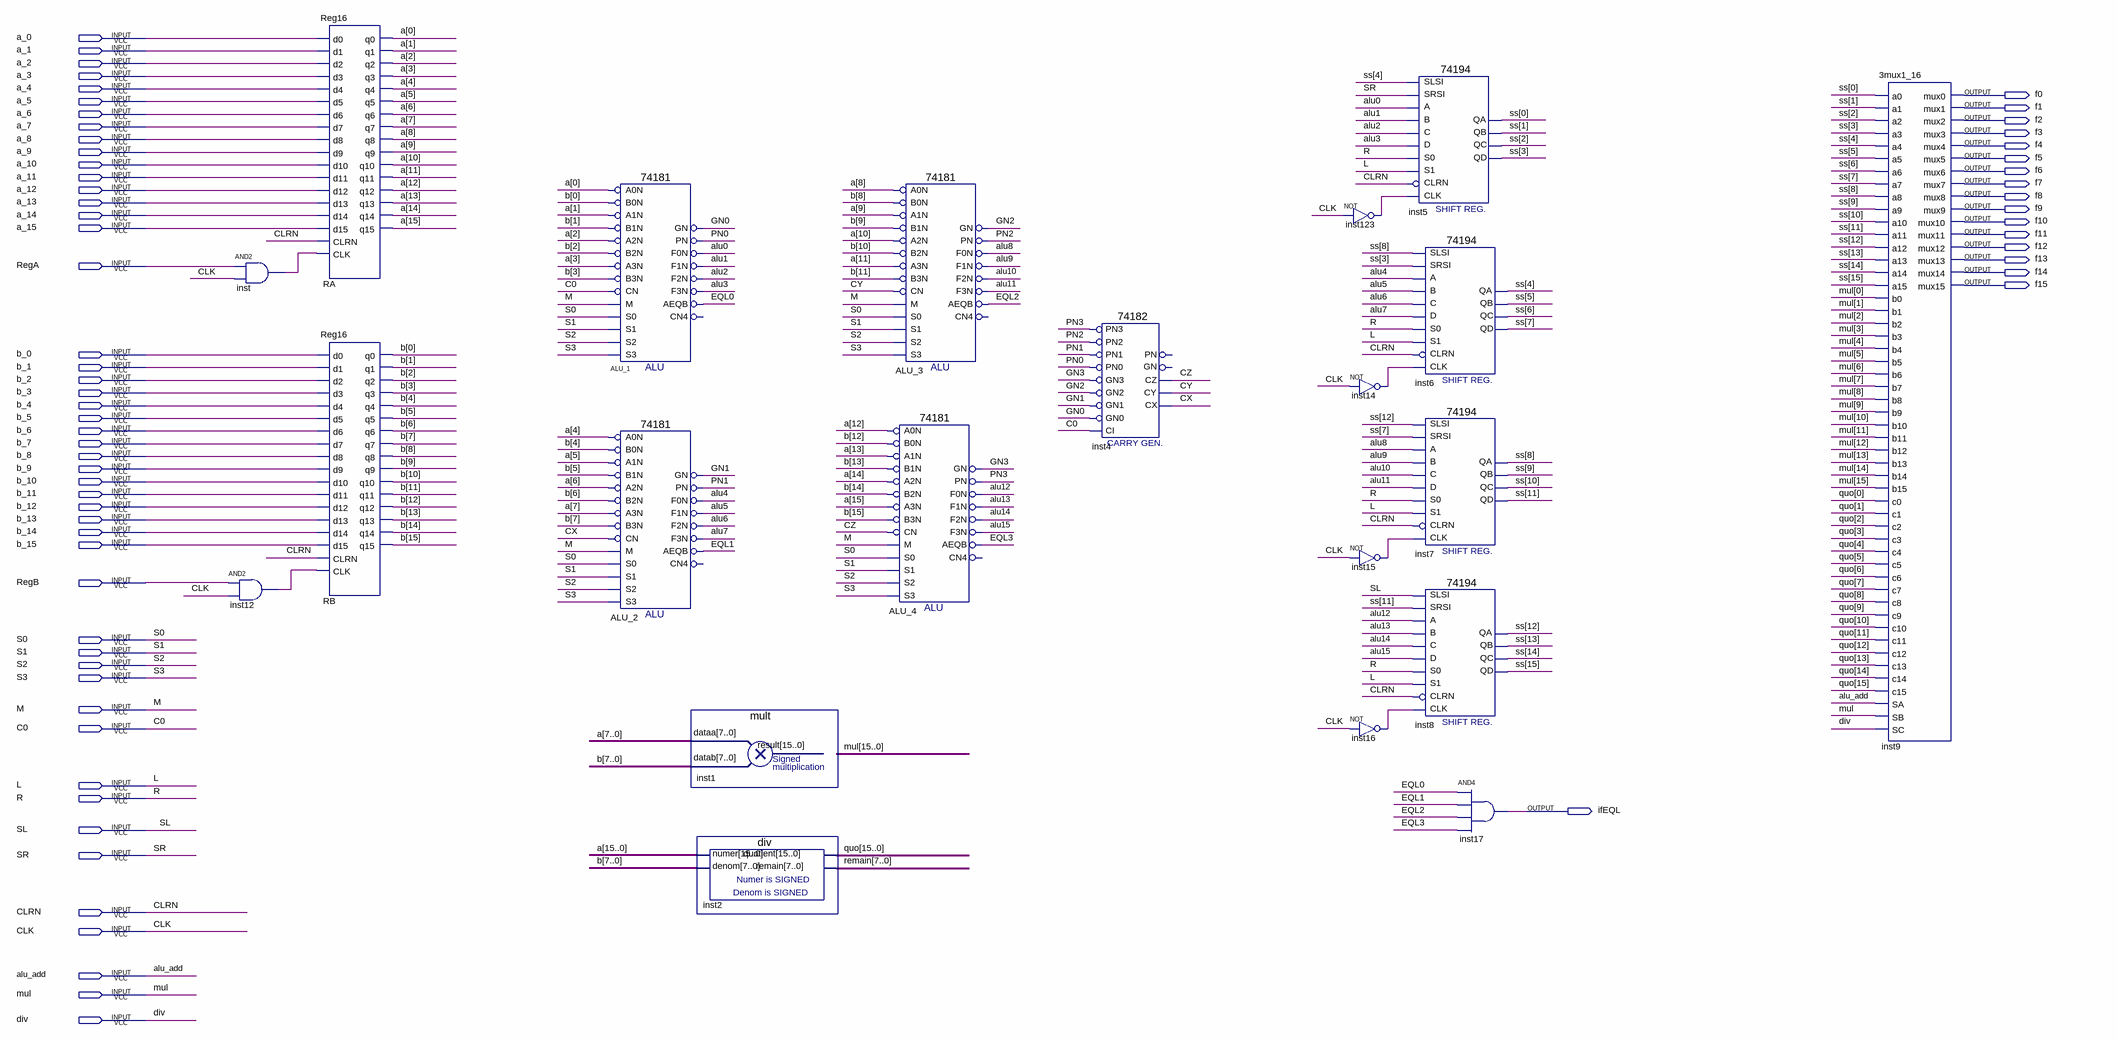
[diagram p0: schematic sheet]
// Quartus schematic ALU.bdf as structural Verilog: 21 symbols, 66 pins
module ALU (
  input  a_0,
  input  a_1,
  input  a_2,
  input  a_3,
  input  a_4,
  input  a_5,
  input  a_6,
  input  a_7,
  input  a_8,
  input  a_9,
  input  a_10,
  input  a_11,
  input  a_12,
  input  a_13,
  input  a_14,
  input  a_15,
  input  RegA,
  input  b_0,
  input  b_1,
  input  b_2,
  input  b_3,
  input  b_4,
  input  b_5,
  input  b_6,
  input  b_7,
  input  b_8,
  input  b_9,
  input  b_10,
  input  b_11,
  input  b_12,
  input  b_13,
  input  b_14,
  input  b_15,
  input  RegB,
  input  S0,
  input  S1,
  input  S2,
  input  S3,
  input  M,
  input  C0,
  input  L,
  input  R,
  input  SL,
  input  SR,
  input  CLRN,
  input  CLK,
  input  alu_add,
  input  mul,
  input  div,
  output f0,
  output f1,
  output f2,
  output f3,
  output f4,
  output f5,
  output f6,
  output f7,
  output f8,
  output f9,
  output f10,
  output f11,
  output f12,
  output f13,
  output f14,
  output f15,
  output ifEQL
);

  wire alu0, alu1, alu2, alu3, alu4, alu5, alu6, alu7, alu8, alu9, alu10, alu11, alu12, alu13, alu14, alu15,
       CX, CY, CZ, EQL0, EQL1, EQL2, EQL3, GN0, GN1, GN2, GN3, inst12_out, inst14_out, inst15_out,
       inst16_out, inst123_out, inst_out, PN0, PN1, PN2, PN3;
  wire [7:0] remain;
  wire [15:0] a, b, mul_bus, quo, ss;

  and inst (inst_out, RegA, CLK);
  and inst12 (inst12_out, RegB, CLK);
  Reg16 RA (
    .d0(a_0), .d1(a_1), .d2(a_2), .d3(a_3), .d4(a_4), .d5(a_5), .d6(a_6), .d7(a_7), .d8(a_8), .d9(a_9),
    .d10(a_10), .d11(a_11), .d12(a_12), .d13(a_13), .d14(a_14), .d15(a_15), .CLRN(CLRN), .CLK(inst_out),
    .q0(a[0]), .q1(a[1]), .q2(a[2]), .q3(a[3]), .q4(a[4]), .q5(a[5]), .q6(a[6]), .q7(a[7]), .q8(a[8]),
    .q9(a[9]), .q10(a[10]), .q11(a[11]), .q12(a[12]), .q13(a[13]), .q14(a[14]), .q15(a[15]));
  Reg16 RB (
    .d0(b_0), .d1(b_1), .d2(b_2), .d3(b_3), .d4(b_4), .d5(b_5), .d6(b_6), .d7(b_7), .d8(b_8), .d9(b_9),
    .d10(b_10), .d11(b_11), .d12(b_12), .d13(b_13), .d14(b_14), .d15(b_15), .CLRN(CLRN), .CLK(inst12_out),
    .q0(b[0]), .q1(b[1]), .q2(b[2]), .q3(b[3]), .q4(b[4]), .q5(b[5]), .q6(b[6]), .q7(b[7]), .q8(b[8]),
    .q9(b[9]), .q10(b[10]), .q11(b[11]), .q12(b[12]), .q13(b[13]), .q14(b[14]), .q15(b[15]));
  \74181  ALU_1 (
    .B0N(b[0]), .A0N(a[0]), .A1N(a[1]), .B1N(b[1]), .A3N(a[3]), .B2N(b[2]), .A2N(a[2]), .M(M), .CN(C0),
    .B3N(b[3]), .S2(S2), .S1(S1), .S0(S0), .S3(S3), .PN(PN0), .GN(GN0), .F3N(alu3), .F1N(alu1), .F0N(alu0),
    .AEQB(EQL0), .F2N(alu2));  // open: CN4
  \74181  ALU_2 (
    .B0N(b[4]), .A0N(a[4]), .A1N(a[5]), .B1N(b[5]), .A3N(a[7]), .B2N(b[6]), .A2N(a[6]), .M(M), .CN(CX),
    .B3N(b[7]), .S2(S2), .S1(S1), .S0(S0), .S3(S3), .PN(PN1), .GN(GN1), .F3N(alu7), .F1N(alu5), .F0N(alu4),
    .AEQB(EQL1), .F2N(alu6));  // open: CN4
  mult inst1 (.dataa(a[7:0]), .datab(b[7:0]), .result(mul_bus));
  div inst2 (.numer(a), .denom(b[7:0]), .quotient(quo), .remain(remain));
  \74181  ALU_3 (
    .B0N(b[8]), .A0N(a[8]), .A1N(a[9]), .B1N(b[9]), .A3N(a[11]), .B2N(b[10]), .A2N(a[10]), .M(M), .CN(CY),
    .B3N(b[11]), .S2(S2), .S1(S1), .S0(S0), .S3(S3), .PN(PN2), .GN(GN2), .F3N(alu11), .F1N(alu9), .F0N(alu8),
    .AEQB(EQL2), .F2N(alu10));  // open: CN4
  \74181  ALU_4 (
    .B0N(b[12]), .A0N(a[12]), .A1N(a[13]), .B1N(b[13]), .A3N(a[15]), .B2N(b[14]), .A2N(a[14]), .M(M),
    .CN(CZ), .B3N(b[15]), .S2(S2), .S1(S1), .S0(S0), .S3(S3), .PN(PN3), .GN(GN3), .F3N(alu15), .F1N(alu13),
    .F0N(alu12), .AEQB(EQL3), .F2N(alu14));  // open: CN4
  \74182  inst4 (
    .PN2(PN2), .GN2(GN2), .GN3(GN3), .PN3(PN3), .CI(C0), .PN1(PN1), .PN0(PN0), .GN1(GN1), .GN0(GN0), .CY(CY),
    .CX(CX), .CZ(CZ));  // open: PN, GN
  not inst123 (inst123_out, CLK);
  not inst14 (inst14_out, CLK);
  not inst15 (inst15_out, CLK);
  not inst16 (inst16_out, CLK);
  \74194  inst5 (
    .SLSI(ss[4]), .SRSI(SR), .B(alu1), .C(alu2), .CLK(inst123_out), .CLRN(CLRN), .D(alu3), .S1(L), .S0(R),
    .A(alu0), .QA(ss[0]), .QB(ss[1]), .QC(ss[2]), .QD(ss[3]));
  \74194  inst6 (
    .SLSI(ss[8]), .SRSI(ss[3]), .B(alu5), .C(alu6), .CLK(inst14_out), .CLRN(CLRN), .D(alu7), .S1(L), .S0(R),
    .A(alu4), .QA(ss[4]), .QB(ss[5]), .QC(ss[6]), .QD(ss[7]));
  \74194  inst7 (
    .SLSI(ss[12]), .SRSI(ss[7]), .B(alu9), .C(alu10), .CLK(inst15_out), .CLRN(CLRN), .D(alu11), .S1(L),
    .S0(R), .A(alu8), .QA(ss[8]), .QB(ss[9]), .QC(ss[10]), .QD(ss[11]));
  \74194  inst8 (
    .SLSI(SL), .SRSI(ss[11]), .B(alu13), .C(alu14), .CLK(inst16_out), .CLRN(CLRN), .D(alu15), .S1(L), .S0(R),
    .A(alu12), .QA(ss[12]), .QB(ss[13]), .QC(ss[14]), .QD(ss[15]));
  and inst17 (ifEQL, EQL0, EQL1, EQL2, EQL3);
  \3mux1_16  inst9 (
    .a0(ss[0]), .a1(ss[1]), .a2(ss[2]), .a3(ss[3]), .a4(ss[4]), .a5(ss[5]), .a6(ss[6]), .a7(ss[7]),
    .a8(ss[8]), .a9(ss[9]), .a10(ss[10]), .a11(ss[11]), .a12(ss[12]), .a13(ss[13]), .a14(ss[14]),
    .a15(ss[15]), .b0(mul_bus[0]), .b1(mul_bus[1]), .b2(mul_bus[2]), .b3(mul_bus[3]), .b4(mul_bus[4]),
    .b5(mul_bus[5]), .b6(mul_bus[6]), .b7(mul_bus[7]), .b8(mul_bus[8]), .b9(mul_bus[9]), .b10(mul_bus[10]),
    .b11(mul_bus[11]), .b12(mul_bus[12]), .b13(mul_bus[13]), .b14(mul_bus[14]), .b15(mul_bus[15]),
    .c0(quo[0]), .c1(quo[1]), .c2(quo[2]), .c3(quo[3]), .c4(quo[4]), .c5(quo[5]), .c6(quo[6]), .c7(quo[7]),
    .c8(quo[8]), .c9(quo[9]), .c10(quo[10]), .c11(quo[11]), .c12(quo[12]), .c13(quo[13]), .c14(quo[14]),
    .c15(quo[15]), .SA(alu_add), .SB(mul), .SC(div), .mux0(f0), .mux1(f1), .mux2(f2), .mux3(f3), .mux4(f4),
    .mux5(f5), .mux6(f6), .mux7(f7), .mux8(f8), .mux9(f9), .mux10(f10), .mux11(f11), .mux12(f12),
    .mux13(f13), .mux14(f14), .mux15(f15));
endmodule
